# EAGLE design PowerSocket (EAGLE 8.1.0)
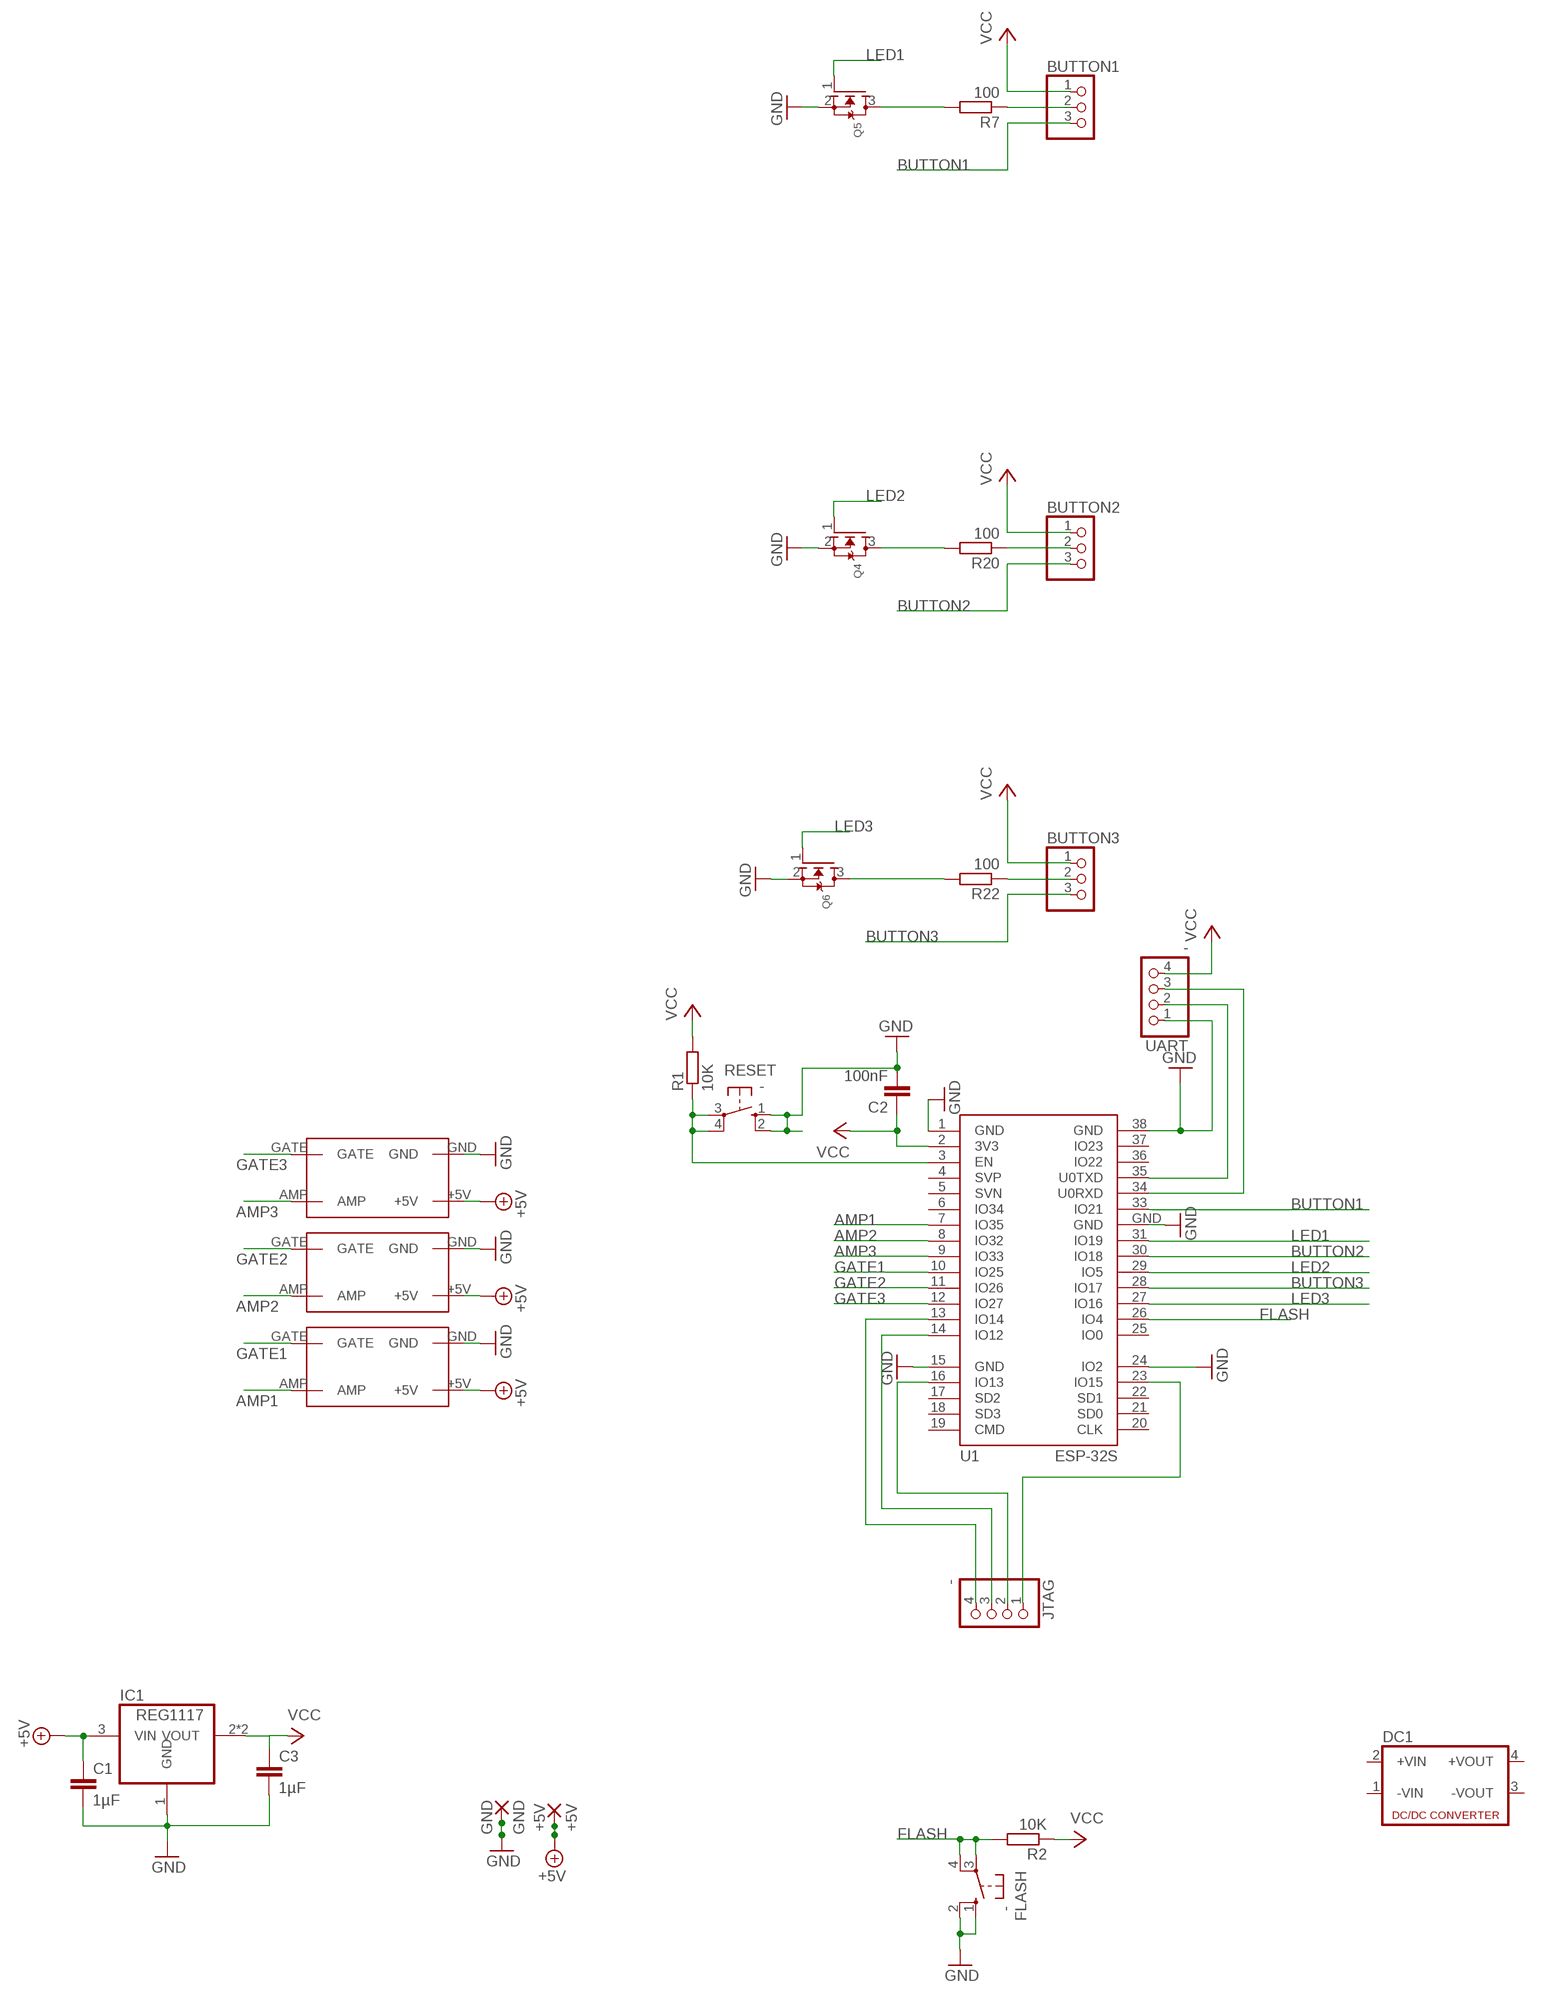
[diagram p0: schematic, sheet 1]

## Parts
+5V  +5V  2,15/1,0  [2,15/1,0]
BUTTON1  PINHD-1X3  [1X03]
BUTTON2  PINHD-1X3  [1X03]
BUTTON3  PINHD-1X3  [1X03]
C1  1µF  C-EU025-024X044  [C025-024X044]
C2  100nF  C-EUC1206  [C1206]
C3  1µF  C-EU025-024X044  [C025-024X044]
DC1  NME  [NME]
FLASH  -  10-XX  [B3F-10XX]
GND  GND  2,15/1,0  [2,15/1,0]
IC1  REG1117  [SOT223]
JTAG  -  PINHD-1X4  [1X04]
Q4  MOSFET-NREFLOW  [SOT23]
Q5  MOSFET-NREFLOW  [SOT23]
Q6  MOSFET-NREFLOW  [SOT23]
R1  10K  R-EU_R0805  [R0805]
R2  10K  R-EU_R0805  [R0805]
R7  100  R-EU_R0805  [R0805]
R20  100  R-EU_R0805  [R0805]
R22  100  R-EU_R0805  [R0805]
RESET  -  10-XX  [B3F-10XX]
U1  ESP-32S  [ESP-32S]
U$2  RELAY_BOARD  [RELAY_BOARD]
U$3  RELAY_BOARD  [RELAY_BOARD]
U$4  RELAY_BOARD  [RELAY_BOARD]
UART  -  PINHD-1X4  [1X04]

## Nets
+5V: +5V.1(P) C1.1 IC1.3(VIN) U$2.+5V U$3.+5V U$4.+5V
AMP1: U1.7(IO35) U$4.AMP
AMP2: U1.8(IO32) U$3.AMP
AMP3: U1.9(IO33) U$2.AMP
BUTTON1: BUTTON1.3 U1.33(IO21)
BUTTON2: BUTTON2.3 U1.30(IO18)
BUTTON3: BUTTON3.3 U1.28(IO17)
FLASH: FLASH.3(P) FLASH.4(P1) R2.2 U1.26(IO4)
GATE1: U1.10(IO25) U$4.GATE
GATE2: U1.11(IO26) U$3.GATE
GATE3: U1.12(IO27) U$2.GATE
GND: C1.2 C2.2 C3.2 FLASH.1(S) FLASH.2(S1) GND.1(P) IC1.1(GND) Q4.2(S) Q5.2(S) Q6.2(S) RESET.1(S) RESET.2(S1) U1.1(GND) U1.15(GND) U1.24(IO2) U1.38(GND) U1.GND U$2.GND U$3.GND U$4.GND UART.1
LED1: Q5.1(G) U1.31(IO19)
LED1_SWITCHED: Q5.3(D) R7.2
LED2: Q4.1(G) U1.29(IO5)
LED2_SWITCHED: Q4.3(D) R20.2
LED3: Q6.1(G) U1.27(IO16)
LED3_SWITCHED: Q6.3(D) R22.2
N$2: JTAG.1 U1.23(IO15)
N$3: JTAG.2 U1.16(IO13)
N$4: JTAG.3 U1.14(IO12)
N$5: JTAG.4 U1.13(IO14)
N$7: BUTTON2.2 R20.1
N$9: BUTTON1.2 R7.1
N$11: BUTTON3.2 R22.1
N$66: R1.1 RESET.3(P) RESET.4(P1) U1.3(EN)
N$70: U1.35(U0TXD) UART.2
N$77: U1.34(U0RXD) UART.3
VCC: BUTTON1.1 BUTTON2.1 BUTTON3.1 C2.1 C3.1 IC1.2(VOUT) IC1.4(VOUT) R1.2 R2.1 U1.2(3V3) UART.4
Unconnected: DC1.1(-VIN) DC1.2(+VIN) DC1.3(-VOUT) DC1.4(+VOUT) U1.4(SVP) U1.5(SVN) U1.6(IO34) U1.17(SD2) U1.18(SD3) U1.19(CMD) U1.20(CLK) U1.21(SD0) U1.22(SD1) U1.25(IO0) U1.36(IO22) U1.37(IO23)

## Library data of the parts
+5V GND = wirepad:2,15/1,0: THROUGH-HOLE PAD
BUTTON1-BUTTON3 = pinhead:PINHD-1X3: PIN HEADER
C1-C3 = rcl:C-EU: CAPACITOR, European symbol
DC1 = dc-dc-converter:NME: DC-DC CONVERTER; MF: C & D TECHNOLOGIES, INC; MPN: NME1205D; OC_FARNELL: 1021466; OC_NEWARK: 98B8198
FLASH RESET = switch-omron:10-XX: OMRON SWITCH; MPN: B3F-1000; OC_FARNELL: 176432; OC_NEWARK: 36M3542
IC1 = burr-brown:REG1117: 800mA and 1A Low Dropout (LDO) Positive Regulator 1.8V, 2.5V, 2.85V, 3.3V, 5V, and Adj; MPN: REG1117; OC_FARNELL: 1097566; OC_NEWARK: 14P6981
JTAG UART = pinhead:PINHD-1X4: PIN HEADER
Q4-Q6 = adafruit:MOSFET-N: N-Channel Mosfet 2N7002E - 60V 260mA SOT23 [Digikey: 2N7002ET1GOSTR-ND] - REEL BSH103 - 30V 850mA SOT23 [Digikey: 568-5013-1-ND]
R1 R2 R7 R20 R22 = rcl:R-EU_: RESISTOR, European symbol
U1 = esp32:ESP-32S: Ai-Thinker ESP-32S
U$2-U$4 = PowerSocket:RELAY_BOARD

## Board
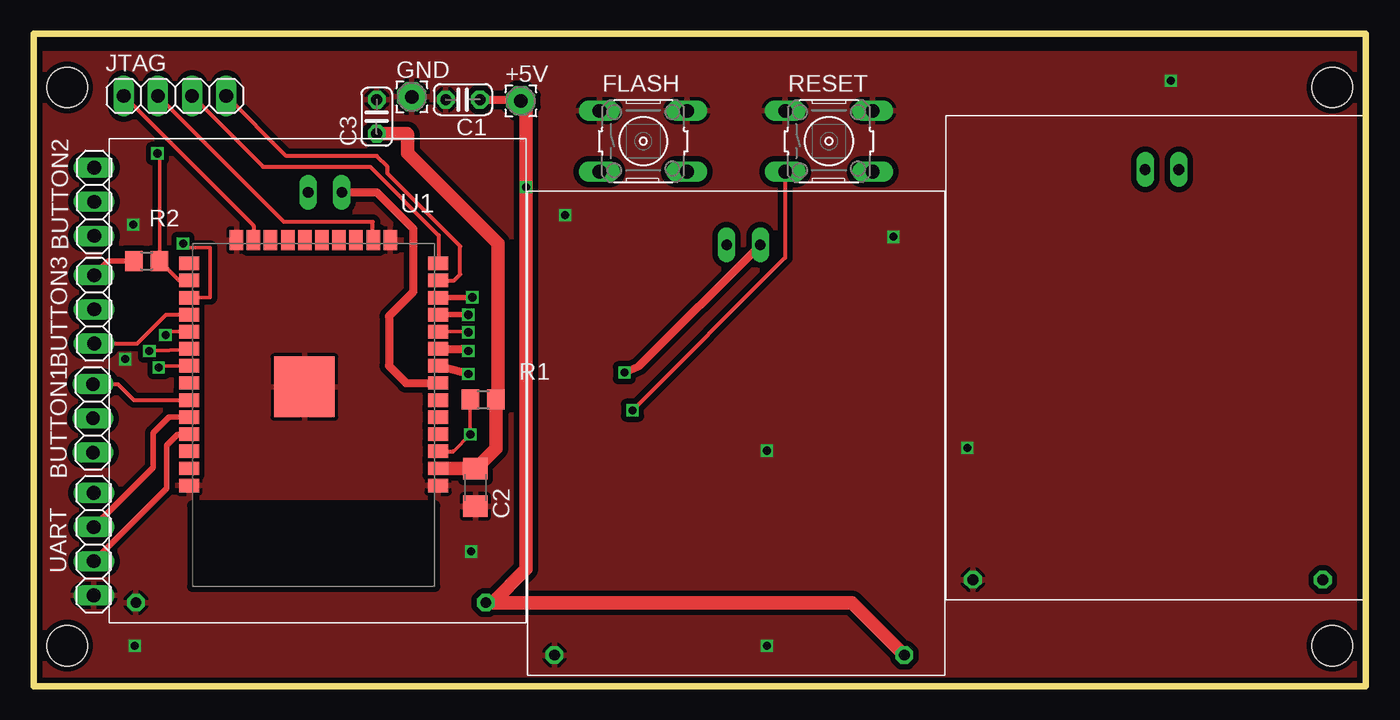
[diagram p1: board, top side]
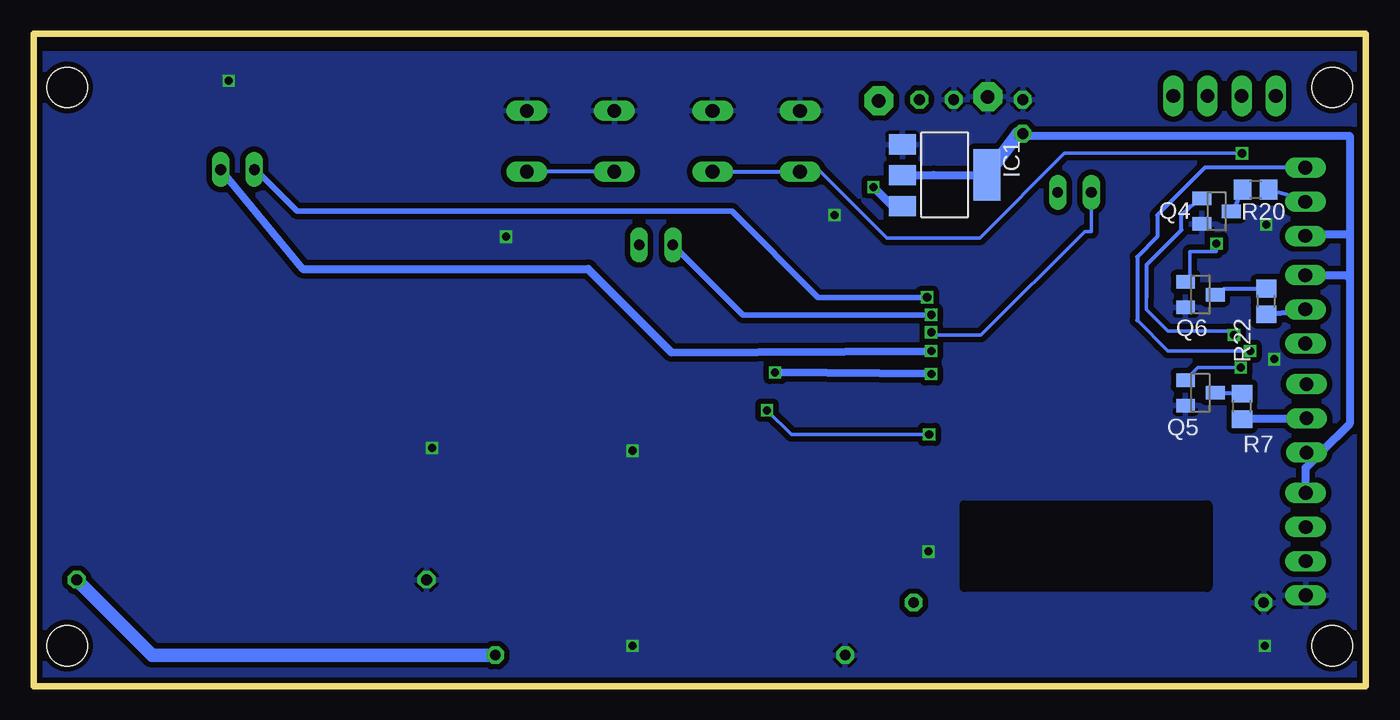
[diagram p2: board, bottom side, seen from below]

Size 99 x 48.5 mm. Coordinates in mm from the lower left corner, seen from the top.
Outline: 0,0 99,0 99,48.5 0,48.5 0,0
Copper layers (1*16): Top 0.035mm / dielectric 1.5mm / Bottom 0.035mm
Design rules "dirt_cheap_dirty_boards.v1": minimum track width 5mil, minimum drill 12mil, track to track 5mil, track to pad 5mil, pad to pad 5mil, via to via 5mil, smd to smd 0mil, copper to edge 10mil, drill to drill 10mil, minimum pad ring 10mil, minimum via ring 6mil, stop-mask expansion 2mil, vias tented up to drill 25mil, thermal gap 10mil
Holes 3 mm at 2.5,3 96.5,3 96.5,44.5 2.5,44.5

### Footprints (pad centres in the part's own frame; a part is rotated, then mirrored left to right if it is on the bottom)
2,15/1,0 = drill 1.016 pad 2.159 octagon: 1 0,0
1X03 = drill 1.016 long: 1 -2.54,0; 2 0,0; 3 2.54,0
C025-024X044 = drill 0.813 octagon: 1 -1.27,0; 2 1.27,0
C1206 = smd 1.6 x 1.8: 1 -1.4,0; 2 1.4,0
NME = drill 0.813 long: 1 0,3.81; 2 0,1.27; 3 0,-1.27; 4 0,-3.81
B3F-10XX = drill 1.016 long: 1 -3.251,2.261; 2 3.251,2.261; 3 -3.251,-2.261; 4 3.251,-2.261
SOT223 = smd 1.499 x 2.007: 1 -2.261,-3.15; 2 0.025,-3.15; 3 2.311,-3.15 | smd 3.81 x 2.007: 4 0,3.15
1X04 = drill 1.016 long: 1 -3.81,0; 2 -1.27,0; 3 1.27,0; 4 3.81,0
SOT23 = smd 1 x 1.4: 1 -0.95,-1.1; 2 0.95,-1.1; 3 0,1.1
R0805 = smd 1.3 x 1.5: 1 -0.95,0; 2 0.95,0
ESP-32S = smd 1.5 x 1: 1 -9.25,7; 2 -9.25,5.73; 3 -9.25,4.46; 4 -9.25,3.19; 5 -9.25,1.92; 6 -9.25,0.65; 7 -9.25,-0.62; 8 -9.25,-1.89; 9 -9.25,-3.16; 10 -9.25,-4.43; 11 -9.25,-5.7; 12 -9.25,-6.97; 13 -9.25,-8.24; 14 -9.25,-9.51; 25 9.25,-9.51; 26 9.25,-8.24; 27 9.25,-6.97; 28 9.25,-5.7; 29 9.25,-4.43; 30 9.25,-3.16; 31 9.25,-1.89; 32 9.25,-0.62; 33 9.25,0.65; 34 9.25,1.92; 35 9.25,3.19; 36 9.25,4.46; 37 9.25,5.73; 38 9.25,7 | smd 1 x 1.5: 15 -5.7,-11.25; 16 -4.43,-11.25; 17 -3.16,-11.25; 18 -1.89,-11.25; 19 -0.62,-11.25; 20 0.65,-11.25; 21 1.92,-11.25; 22 3.19,-11.25; 23 4.46,-11.25; 24 5.73,-11.25 | smd 4.5 x 4.5: GND 0.68,-0.33
RELAY_BOARD = drill 0.8 octagon: +5V 28,1.5; GND 2,1.5 | drill 0.8 long: AMP 17.3,32; GATE 14.8,32

### Placement (x,y rotation side)
+5V  36.2,43.5 0 top
BUTTON1  4.4,19.9 90 top
BUTTON2  4.5,36 90 top
BUTTON3  4.5,28 270 top
C1  31.9,43.6 180 top
C2  32.83,14.76 270 top
C3  25.5,42.33 90 top
DC1  -9.9,6.2 0 top  (outside the outline)
FLASH  45.3,40.5 0 top
GND  28.1,43.8 0 top
IC1  31.3,38 270 bottom
JTAG  10.5,43.87 0 top
Q4  11.1,35.3 270 bottom
Q5  12.3,21.8 270 bottom
Q6  12.3,29.1 270 bottom
R1  33.4,21.3 0 top
R2  8.4,31.6 0 top
R7  9.2,20.8 90 bottom
R20  8.2,36.9 180 bottom
R22  7.4,28.6 90 bottom
RESET  59.1,40.5 0 top
U1  20.8,21.91 180 top
U$2  67.8,6.4 0 top
U$3  36.7,0.8 0 top
U$4  5.6,4.7 0 top
UART  4.47,10.55 90 top

### Tracks (layer width: path | path; a pad name or v marks a point on that pad's centre or on a via)
+5V  (via drill 0.6)
  Top 0.61: 34.1,6.2 U$4.+5V | 36.6,43.5 +5V.1 36.1,43.6 C1.1
  Top 1.016: U$4.+5V 60.8,6.2 U$3.+5V | 34.1,6.2 36.6,8.7 v36.6,37.1 36.6,43.5
  Bottom 0.61: IC1.3 34.69,35.59 35.09,35.59 v36.6,37.1
  Bottom 1.016: U$3.+5V 90.2,2.3 U$2.+5V
AMP1
  Top 0.61: U1.7 27.67,22.53 26.4,23.8 26.4,27.5 28.2,29.3 28.2,34 25.5,36.7 U$4.AMP
AMP2  (via drill 0.6)
  Top 0.61: v32.3,23.2 U1.8 | U$3.AMP 45,23.8 v43.9,23.3
  Bottom 0.61: v32.3,23.2 v43.9,23.3
AMP3  (via drill 0.6)
  Top 0.61: U1.9 31.87,25.07 v32.3,24.9
  Bottom 0.61: U$2.AMP 79,31 57.8,31 51.6,24.8 v32.3,24.9
BUTTON1
  Top 0.305: 11.49,21.2 U1.33 7.44,21.26 6.26,22.44 BUTTON1.3
BUTTON2  (via drill 0.6)
  Top 0.305: U1.30 11.62,25 v8.6,24.9
  Bottom 0.254: 17,27.2 14.7,24.9 v8.6,24.9
  Bottom 0.305: 17,27.2 17,31.9 15.5,33.4 15.5,35 11.96,38.54 BUTTON2.3
BUTTON3
  Top 0.305: U1.28 9.84,27.61 7.69,25.46 6.51,25.46 BUTTON3.3
FLASH  (via drill 0.6)
  Top 0.254: v9.2,39.6 9.35,39.45 R2.2
  Top 0.305: U1.26 10.8,30.15 R2.2
  Bottom 0.254: FLASH.3 40.54,38.24 35.6,33.3 28.7,33.3 22.4,39.6 v9.2,39.6
  Bottom 0.305: FLASH.4 FLASH.3
GATE1  (via drill 0.6)
  Top 0.254: U1.10 32.26,26.34 v32.3,26.3
  Bottom 0.254: U$4.GATE 20.4,33.8 20.9,33.8 28.6,26.1 32.1,26.1 v32.3,26.3
GATE2  (via drill 0.6)
  Top 0.406: U1.11 32.09,27.61 32.1,27.6 v32.3,27.6
  Bottom 0.406: v32.3,27.6 46.3,27.6 U$3.GATE
GATE3  (via drill 0.6)
  Top 0.305: 32.58,28.88 v32.6,28.9
  Top 0.406: U1.12 32.58,28.88
  Bottom 0.305: 82.4,38.2 U$2.GATE 82.5,38.4
  Bottom 0.406: v32.6,28.9 40.7,28.9 47.1,35.3 79.4,35.3 82.5,38.4
GND  (via drill 0.6)
  other vias: 7.4,34.3 7.5,3 54.5,3 54.5,17.5 69.4,17.7 39.5,35 84.5,45 32.5,10 63.9,33.4 6.8,24.3
  pour Top (isolate 0.406): 0,47 0,0.5 99,0.5 99,47
  pour Bottom (isolate 0.406): 0,0.5 99,0.5 99,8.8 98.9,26.3 98.9,47 0,47
LED1  (via drill 0.6)
  Top 0.254: v9.3,23.68 9.42,23.8 12,23.8
  Top 0.305: U1.31 12,23.8
  Bottom 0.254: v9.3,23.68 12.47,23.68 Q5.1
LED1_SWITCHED
  Bottom 0.305: Q5.3 9.25,21.8 R7.2
LED2  (via drill 0.6)
  Top 0.254: U1.29 10.04,26.34 v9.8,26.1
  Bottom 0.254: 16.3,28.9 16.3,28 14.7,26.4 10.1,26.4 v9.8,26.1
  Bottom 0.305: 16.3,28.9 16.3,31.3 13.7,33.9 13.7,35 13.05,35.65 Q4.1
LED2_SWITCHED
  Bottom 0.305: Q4.3 9.85,35.35 R20.2
LED3  (via drill 0.6)
  Top 0.254: U1.27 13.1,28.88 13.1,32.6 11.1,32.6 v11.1,32.9
  Bottom 0.254: Q6.1 13.1,30.05 13.1,32.3 11.1,32.3 v11.1,32.9
  Bottom 0.305: 13.55,30.2 Q6.1
LED3_SWITCHED
  Bottom 0.305: Q6.3 10.55,29.55 R22.2
N$2
  Top 0.305: JTAG.1 16.34,34.22 U1.23
N$3
  Top 0.305: U1.16 25.19,34.5 18.6,34.5 JTAG.2
N$4
  Top 0.305: JTAG.3 17.04,38.6 25,38.6 30.1,33.5 30.1,31.47 U1.14
N$5
  Top 0.305: U1.13 31.25,30.15 31.7,30.6 31.7,32.7 26.3,38.1 26.3,38.6 25.5,39.4 18.78,39.4 JTAG.4
N$7
  Bottom 0.305: BUTTON2.2 5.95,36.55 R20.1
N$9
  Bottom 0.61: R7.1 4.45,19.85 BUTTON1.2
N$11
  Bottom 0.406: R22.1 4.65,27.85 BUTTON3.2
N$66  (via drill 0.6)
  Top 0.254: 31.2,17.45 v32.45,18.7 R1.1
  Top 0.305: U1.3 31.2,17.45 | RESET.3 55.85,31.85 v44.5,20.5
  Bottom 0.254: v44.5,20.5 42.7,18.7 v32.45,18.7
  Bottom 0.305: RESET.3 RESET.4
N$70
  Top 0.406: UART.2 9.9,14.71 9.9,17.9 10.72,18.72 U1.35
N$77
  Top 0.406: UART.3 8.9,16.25 8.9,18.8 10.09,19.99 U1.34
VCC
  Top 0.406: R2.1 5.56,31.6 BUTTON3.1
  Top 0.61: R1.2 34.5,18.85 | 32.81,16.18 C2.1 | 27.8,41 27.74,41.06
  Top 1.016: C2.1 34.35,17.68 R1.2 34.5,21.45 34.5,32.9 27.8,39.6 27.8,41 | U1.2 32.81,16.18 | 27.74,41.06 C3.1
  Bottom 0.61: 1.2,33.6 1.2,40.9 25.34,40.9 C3.1 25.85,41.06 | 1.2,33.6 1.2,30.3 | 1.2,30.3 1.2,19.5 3.3,17.4 | 3.3,17.4 4.47,16.23 UART.4 | BUTTON2.1 4.36,33.6 1.2,33.6 | BUTTON1.1 4.36,17.4 3.3,17.4 | BUTTON3.1 1.44,30.54 1.2,30.3 | IC1.2 32.12,38 IC1.4
  Bottom 1.016: 25.85,41.06 IC1.4